# Altium schematic sheet USB.SchDoc
size A4; SheetNumber: 7; SheetTotal: 9
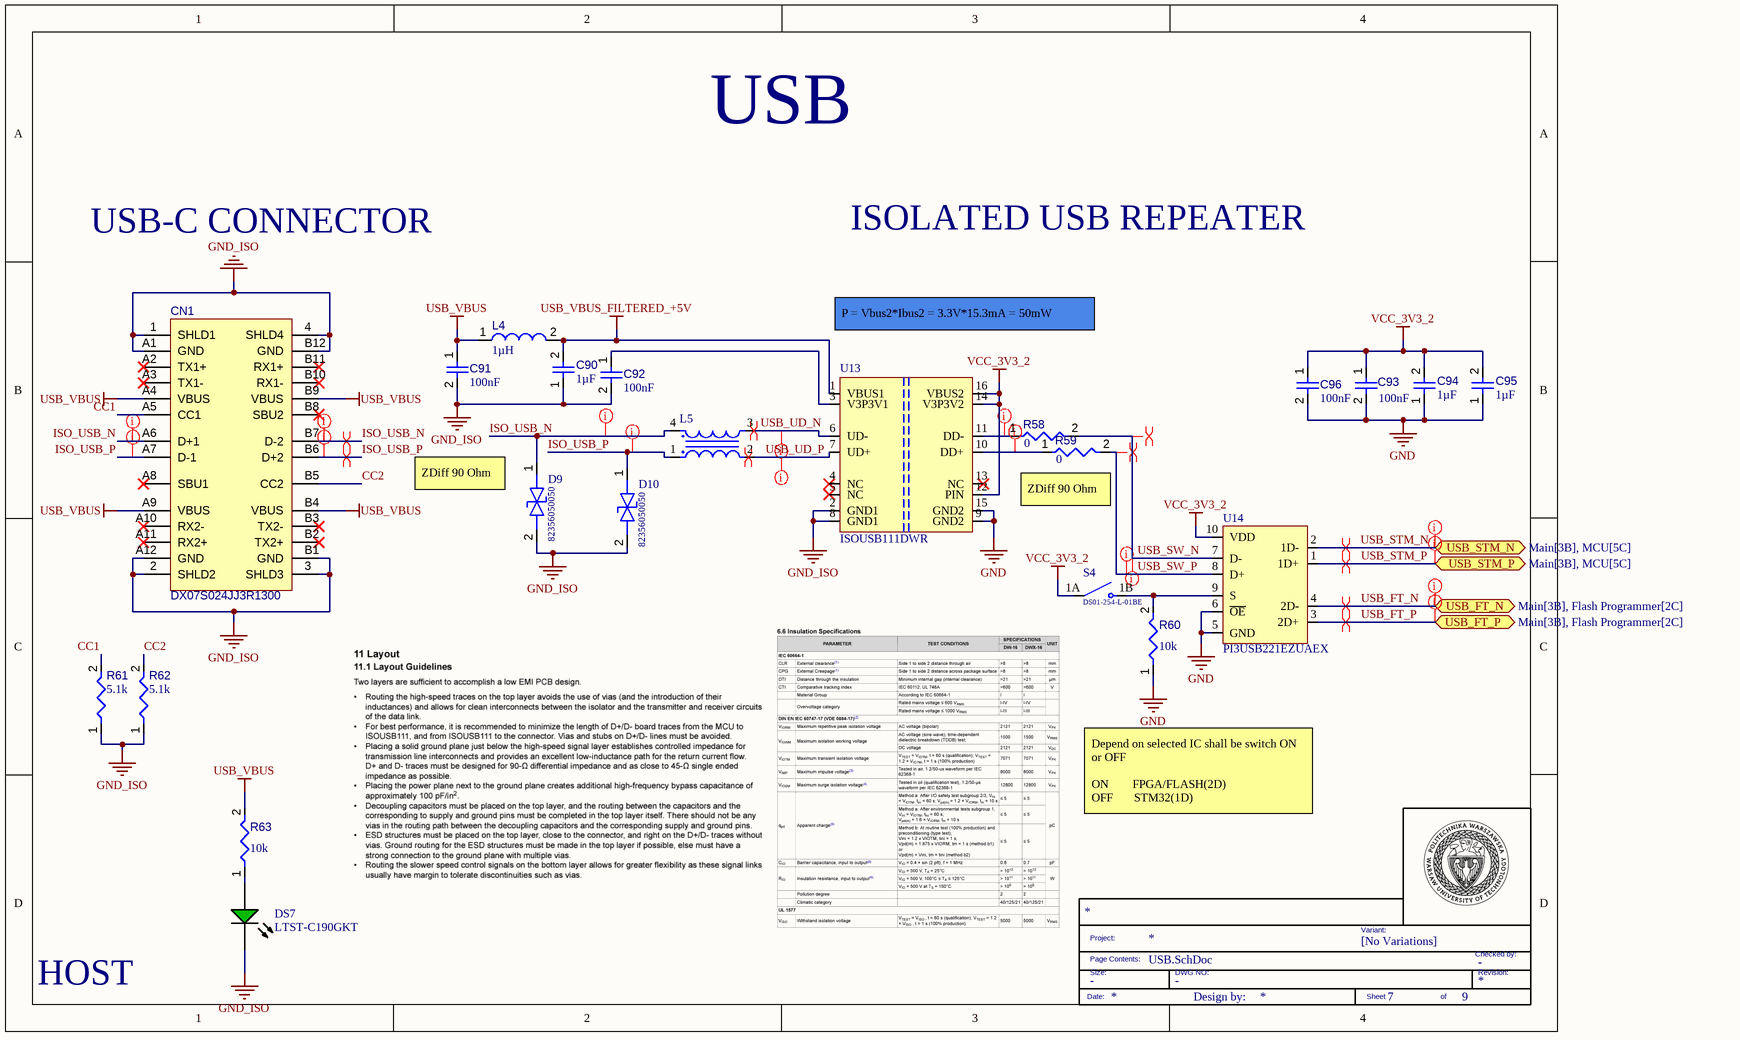
[diagram p0: USB.SchDoc]

## Parts
*?  TITLE_BLOCK  (value not drawn)  (graphical)
C90  value 1µF  [FP-CL10-IPC_C]  (hidden comment: CL10B105KA8NFNC)
C91  value 100nF  [FP-C0603C-CF-IPC_B]  (hidden comment: C0603C104K5RAC7411)
C92  value 100nF  [FP-C0603C-CF-IPC_B]  (hidden comment: C0603C104K5RAC7411)
C93  value 100nF  [FP-C0603C-CF-IPC_C]  (hidden comment: C0603C104K5RAC7411)
C94  value 1µF  [FP-CL10-IPC_B]  (hidden comment: CL10B105KA8NFNC)
C95  value 1µF  [FP-CL10-IPC_B]  (hidden comment: CL10B105KA8NFNC)
C96  value 100nF  [FP-C0603C-CF-IPC_C]  (hidden comment: C0603C104K5RAC7411)
CN1  DX07S024JJ3R1300  [JAE-DX07S024JJ3_V]
D9  82356050050  [0603]
D10  82356050050  [0603]
DS7  LTST-C190GKT  [LTST-C190GKT_V]
L4  value 1µH  [INDC2520X120X60NL20T20]  (hidden comment: LQM2HPN1R0MJ0L)
L5  SRF4532-1R0Y  [SRF4532-1R0Y-Footprint-1]  (value not drawn)
R58  value 0  [RESC0603(1608)_L]  (hidden comment: 0R3J)
R59  value 0  [RESC0603(1608)_L]  (hidden comment: 0R3J)
R60  value 10k  [RESC1608X05N]  (hidden comment: CRCW060310K0FKTC)
R61  value 5.1k  [RESC1608X55X25LL10T15]  (hidden comment: 0603SAF5101T5E)
R62  value 5.1k  [RESC1608X55X25LL10T15]  (hidden comment: 0603SAF5101T5E)
R63  value 10k  [RESC1608X05N]  (hidden comment: CRCW060310K0FKTC)
S4  DS01-254-L-01BE  [SW_DS01-254-L-01BE]
U13  ISOUSB111DWR  [SOIC127P1030X265-16N]
U14  PI3USB221EZUAEX  [PI3USB221EZUAEX-Footprint-1]

## Ports
USB_FT_N (bidir, see Main[3B], Flash Programmer[2C]), USB_FT_P (bidir, see Main[3B], Flash Programmer[2C]), USB_STM_N (bidir, see Main[3B], MCU[5C]), USB_STM_P (bidir, see Main[3B], MCU[5C])

## Nets
GND: C93.2 C94.1 C95.1 C96.2 R60.1 U13.9(GND2) U13.15(GND2) U14.5(GND) U14.6(~{OE})
GND_ISO: C90.1 C91.2 C92.2 CN1.1(SHLD1) CN1.2(SHLD2) CN1.3(SHLD3) CN1.4(SHLD4) CN1.A1(GND) CN1.A12(GND) CN1.B1(GND) CN1.B12(GND) D9.2(A) D10.2(A) DS7.2(K) R61.1 R62.1 U13.2(GND1) U13.8(GND1)
USB_VBUS: C91.1 CN1.A4(VBUS) CN1.A9(VBUS) CN1.B4(VBUS) CN1.B9(VBUS) L4.1 R63.2
USB_VBUS_FILTERED_+5V: C90.2 L4.2 U13.1(VBUS1)
VCC_3V3_2: C93.1 C94.2 C95.2 C96.1 S4.1A(COM1) U13.12(PIN) U13.14(V3P3V2) U13.16(VBUS2) U14.10(VDD)
CC1: CN1.A5(CC1) R61.2
CC2: CN1.B5(CC2) R62.2
ISO_USB_N: CN1.A6(D+1) CN1.B7(D-2) D9.1(K) L5.4
ISO_USB_P: CN1.A7(D-1) CN1.B6(D+2) D10.1(K) L5.1
USB_FT_N: U14.4(2D-) ; port USB_FT_N
USB_FT_P: U14.3(2D+) ; port USB_FT_P
USB_STM_N: U14.2(1D-) ; port USB_STM_N
USB_STM_P: U14.1(1D+) ; port USB_STM_P
USB_SW_N: R58.2 U14.7(D-)
USB_SW_P: R59.2 U14.8(D+)
USB_UD_N: L5.3 U13.6(UD-)
USB_UD_P: L5.2 U13.7(UD+)
NetC92_1: C92.1 U13.3(V3P3V1)
NetDS7_1: DS7.1(A) R63.1
NetR58_1: R58.1 U13.11(DD-)
NetR59_1: R59.1 U13.10(DD+)
NetR60_2: R60.2 S4.1B(NO1) U14.9(S)

Not connected (* = marked no-connect by the designer): CN1 A2(TX1+)* A3(TX1-)* A8(SBU1)* A10(RX2-)* A11(RX2+)* B2(TX2+)* B3(TX2-)* B8(SBU2)* B10(RX1-)* B11(RX1+)*; U13 4(NC)* 5(NC)* 13(NC)*

## Layout directives
differential pair: ISO_USB_N, ISO_USB_P, USB_FT_N, USB_FT_P, USB_STM_N, USB_STM_P, USB_SW_N, USB_SW_P, USB_UD_N, USB_UD_P
mark named USB: ISO_USB_N, ISO_USB_P, NetR58_1, NetR59_1, USB_FT_N, USB_FT_P, USB_STM_N, USB_STM_P, USB_SW_N, USB_SW_P, USB_UD_N, USB_UD_P

## Notes on the sheet
- USB
- USB-C CONNECTOR
- ISOLATED USB REPEATER
- P = Vbus2*Ibus2 = 3.3V*15.3mA = 50mW
- (near D9) ZDiff 90 Ohm
- (near R59) ZDiff 90 Ohm
- Depend on selected IC shall be switch ON or OFF
  ON        FPGA/FLASH(2D)
  OFF       STM32(1D)
- HOST
- (in symbol CMP-003-000005-7) Variant:; Project:; [No Variations]; Checked by:; Page Contents:; Size:; DWG NO:; Revision:; Date:; Design by:; Sheet; of

## Library data of the parts
*? = CMP-003-000005-7: TITLEBLOCK; DWG NO: -; Size: -; Checked by: -; Design Item ID: TITLE_BLOCK; Source: TITLEBLOCK.SchLib
C90 C94 C95 = CMP-001-00085-5: Ceramic Capacitor, Multilayer, Ceramic, 25V, 10% +Tol, 10% -Tol, X7R, 15% TC, 1uF, Surface Mount, 0603; Max Operating Temperature: 125°C; Pins: 2; RoHS Compliant: Yes; Min Operating Temperature: -55°C; Capacitor Type: Ceramic; Mounting Technology: Surface Mount; Case/Package: 0603
C91-C93 C96 = CMP-001-00086-8: Ceramic Capacitor, Multilayer, Ceramic, 50V, 10% +Tol, 10% -Tol, X7R, 15% TC, 0.1uF, Surface Mount, 0603; Capacitor Type: Ceramic; Max Operating Temperature: 125°C; Case/Package: 0603; Pins: 2; Min Operating Temperature: -55°C; RoHS Compliant: Yes; Mounting Technology: Surface Mount
CN1 = CMP-002-00065-4: USB-C Connector, 20 V, 1.25 A, -30 to 80 degC, RoHS, Tape and Reel; Gender: Receptacle; Connector Type: USB-C; Pins: 28
D9 D10 = CMP-004-00031-1: Trans Voltage Suppressor Diode, 5V V(RWM), Bidirectional, 1 Element, Silicon; Peak Inverse Voltage: 75V; Case/Package: 0603; Min Operating Temperature: -40°C; Max Operating Temperature: 85°C; RoHS Compliant: Yes; Pins: 2
DS7 = CMP-007-00022-2: LED Uni-Color Green, 100 mW, 30 mA, -55 to 85 degC, 2-Pin SMD, RoHS, Tape and Reel; Manufacturer: Lite-On; Power: 100mW; Forward Voltage: 2.1V; Viewing Angle: 130degrees; Forward Current: 20mA; Luminous Intensity: 6mcd; Lens Style: Clear; Manufacturer URL: http://www.us.liteon.com/; RoHS Compliant: True; Colour: Green; Package Description: 2-Pin Surface Mount Device, Body 1.6 x 0.8 mm; Datasheet URL: http://datasheet.octopart.com/LTST-C190GKT-Lite-On-datasheet-158530.pdf; Datasheet Version: Dec-06; Mounting Technology: SM; Case/Package: 0603; Package Reference: C190GKT; Packaging: TapeandReel; Min Operating Temperature: -55°C; Nominal Vf: 2.1V; Package Quantity: 3000; Illumination Colour: Green; Max Operating Temperature: 85°C; Pins: 2
L4 = CMP-006-00008-6: Chip Inductor, 1 uH, +/- 20%, 1 MHz, -55 to 125 degC, 1008 (2520 Metric), RoHS, Tape and Reel; Manufacturer: Murata; Self Resonant Frequency: 70MHz; Current Rating: 1.5A; Shielding: Shielded; Core Material: Ferrite; Resistance: 0.09Ohm; Datasheet URL: http://psearch.en.murata.com/inductor/product/LQM2HPN1R0MJ0%23.pdf; Datasheet Version: Aug-16; RoHS Compliant: True; Case/Package: 1008; Package Description: 2-Pin Surface Mount Device, Body 2.5 x 2 mm; Package Quantity: 3000; Tolerance: 20%; Min Operating Temperature: -40°C; Package Reference: 1008; Packaging: TapeandReel; Mounting Technology: SM; Max Operating Temperature: 85°C
L5 = CMP-006-00026-1: Data Line Filter, 2 Function(s), 50V, 1.2A, 4 Pin(s); RoHS Compliant: Yes
R58 R59 = CMP-009-00063-3: Jumper 0603 (1608 Metric); Case/Package: 0603; Mounting Technology: SMT; Pins: 2
R60 R63 = CMP-009-00187-2: Fixed Resistor, Metal Glaze/thick Film, 0.1W, 10000ohm, 75V, 1% +/-Tol, 100ppm/Cel, Surface Mount, 0603; Power: 100mW; Voltage Rating: 75V; Case/Package: 0603; Tolerance: 1%; Min Operating Temperature: -55°C; Mounting Technology: Surface Mount; Max Operating Temperature: 155°C; RoHS Compliant: No; Pins: 2
R61 R62 = CMP-009-00212-2: Chip Resistor, 5.1 KOhm, +/- 1%, 01 W, -55 to 155 degC, 0603 (1608 Metric); Power: 100mW; Voltage Rating: 50V; Case/Package: 0603; RoHS Compliant: True; Max Operating Temperature: 155°C; Min Operating Temperature: -55°C; Tolerance: 1%; Mounting Technology: SM; Pins: 2
S4 = CMP-011-00013-2: 1 Position, Through Hole, 2.54 mm Pitch, Raised Slide Actuator, Flat Bottom, Long Pin, DIP Switch; MF: CUI Devices; SnapEDA_Link: https://www.snapeda.com/parts/DS01-254-L-01BE/CUI+Devices/view-part/?ref=snap; Purchase-URL: https://pricing.snapeda.com/search/part/DS01-254-L-01BE/?ref=eda; Price: None; Value: *; MP: DS01-254-L-01BE; Component Type: Standard; CUI_purchase_URL: https://www.cuidevices.com/product/switches/dip-switches/ds01-254-series?utm_source=snapeda.com&utm_medium=referral&utm_campaign=snapedaBOM; Case/Package: None; Design Item ID: DS01-254-L-01BE; Pins: 2; Check_prices: https://www.snapeda.com/parts/DS01-254-L-01BE/CUI+Devices/view-part/?ref=eda; Source: DS01-254-L-01BE.SchLib; Availability: In Stock
U13 = CMP-031-00011-4: USB Interface IC Low emissions, full/low speed isolated USB repeater; Min Supply Voltage: 4.25V; Max Supply Voltage: 5.5V; Case/Package: SOIC-16; Min Operating Temperature: -40°C; Max Operating Temperature: 125°C; Pins: 16
U14 = CMP-031-00023-2: Analog Multiplexer Single 1: 2 10-Pin UQFN T/R; Pins: 10; Min Operating Temperature: -40°C; RoHS Compliant: Yes; Max Operating Temperature: 85°C